# EAGLE design KRSTI Comunication (EAGLE 7.7.0)
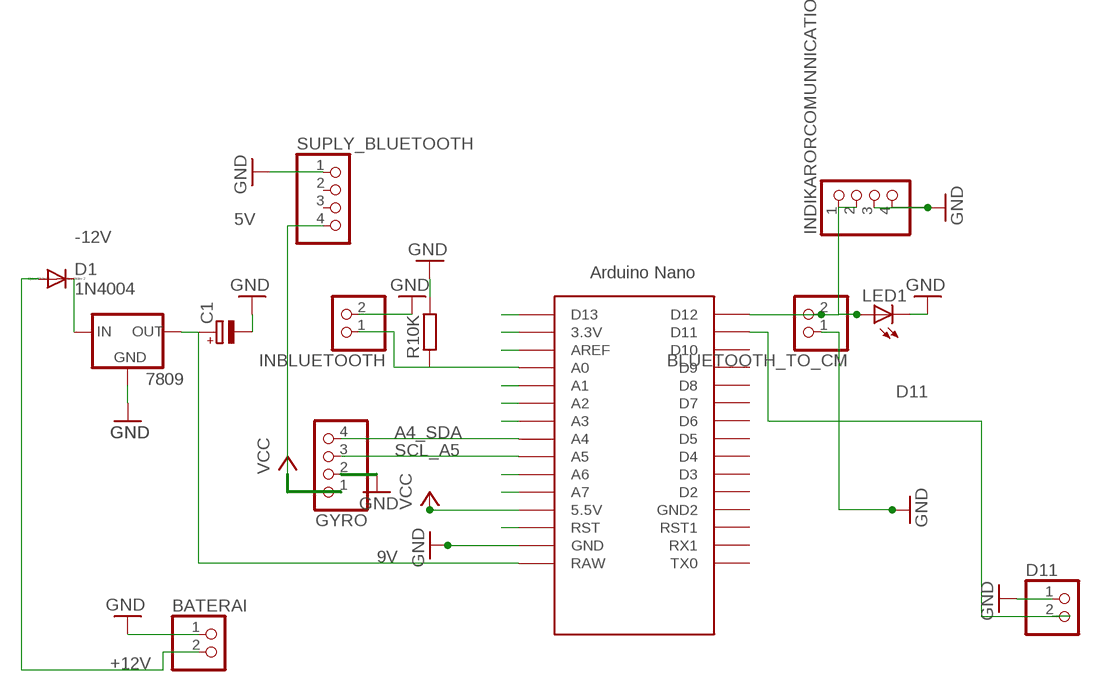
[diagram p0: schematic, sheet 1]

## Parts
7809  78XXL  [78XXL]
BATERAI  PINHD-1X2/90  [1X02/90]
BLUETOOTH_TO_CM  PINHD-1X2  [1X02]
C1  CPOL-EUE2.5-5  [E2,5-5]
D1  1N4004  [DO41-10]
D11  PINHD-1X2  [1X02]
GYRO  PINHD-1X4  [1X04]
INBLUETOOTH  PINHD-1X2  [1X02]
INDIKARORCOMUNNICATION  PINHD-1X4/90  [1X04/90]
LED1  LED5MM  [LED5MM]
R10K  R-EU_0207/7  [0207/7]
SUPLY_BLUETOOTH  PINHD-1X4  [1X04]
U$1  NANO  [NANO]

## Nets
3.3V: U$1.3.3V
5V: GYRO.1 SUPLY_BLUETOOTH.4 U$1.5V(5.5V) ; supply symbol labelled VCC
9V: 7809.OUT C1.+ U$1.RAW
+12V: BATERAI.2 D1.A
-12V: 7809.IN D1.C
A0: INBLUETOOTH.1 R10K.1 U$1.A0
A1: U$1.A1
A2: U$1.A2
A3: U$1.A3
A4_SDA: GYRO.4 U$1.A4
A6: U$1.A6
A7: U$1.A7
D11: D11.2 U$1.D11
D12: BLUETOOTH_TO_CM.2 INDIKARORCOMUNNICATION.1 INDIKARORCOMUNNICATION.2 LED1.A U$1.D12
D13: U$1.D13
GND: 7809.GND BATERAI.1 BLUETOOTH_TO_CM.1 C1.- D11.1 GYRO.2 INBLUETOOTH.2 INDIKARORCOMUNNICATION.3 INDIKARORCOMUNNICATION.4 LED1.K(C) R10K.2 SUPLY_BLUETOOTH.1 U$1.GND
N$13: U$1.AREF
RESET: U$1.RST
SCL_A5: GYRO.3 U$1.A5
Unconnected: SUPLY_BLUETOOTH.2 SUPLY_BLUETOOTH.3 U$1.D2 U$1.D3 U$1.D4 U$1.D5 U$1.D6 U$1.D7 U$1.D8 U$1.D9 U$1.D10 U$1.GND1(GND2) U$1.ICSP1 U$1.ICSP2 U$1.ICSP3 U$1.ICSP4 U$1.ICSP5 U$1.ICSP6 U$1.RST1 U$1.RX1 U$1.TX0

## Library data of the parts
7809 = v-reg:78XXL: VOLTAGE REGULATOR
BATERAI BLUETOOTH_TO_CM D11 INBLUETOOTH = pinhead:PINHD-1X2: PIN HEADER
C1 = resistor:CPOL-EU: POLARIZED CAPACITOR, European symbol
D1 = diode:1N4004: DIODE general purpose rectifier, 1 A
GYRO INDIKARORCOMUNNICATION SUPLY_BLUETOOTH = pinhead:PINHD-1X4: PIN HEADER
LED1 = led:LED: LED OSRAM: - CHIPLED LG R971, LG N971, LY N971, LG Q971, LY Q971, LO R971, LY R971 LH N974, LH R974 LS Q976, LO Q976, LY Q976 LO Q996 - Hyper CHIPLED LW Q18S LB Q993, LB Q99A, LB R99A - SideLED LS A670, LO A670, LY A670, LG A670, LP A670 LB A673, LV A673, LT A673, LW A673 LH A674 LY A675 LS A676, LA A676, LO A676, LY A676, LW A676 LS A679, LY A679, LG A679 - Hyper Micro SIDELED® LS Y876, LA Y876, LO Y876, LY Y876 LT Y87S - SmartLED LW L88C, LW L88S LB L89C, LB L89S, LG L890 LS L89K, LO L89K, LY L89K LS L896, LA L896, LO L896, LY L896 - TOPLED LS T670, LO T670, LY T670, LG T670, LP T670 LSG T670, LSP T670, LSY T670, LOP T670, LYG T670 LG T671, LOG T671, LSG T671 LB T673, LV T673, LT T673, LW T673 LH T674 LS T676, LA T676, LO T676, LY T676, LB T676, LH T676, LSB T676, LW T676 LB T67C, LV T67C, LT T67C, LS T67K, LO T67K, LY T67K, LW E67C LS E67B, LA E67B, LO E67B, LY E67B, LB E67C, LV E67C, LT E67C LW T67C LS T679, LY T679, LG T679 LS T770, LO T770, LY T770, LG T770, LP T770 LB T773, LV T773, LT T773, LW T773 LH T774 LS E675, LA E675, LY E675, LS T675 LS T776, LA T776, LO T776, LY T776, LB T776 LHGB T686 LT T68C, LB T68C - Hyper Mini TOPLED® LB M676 - Mini TOPLED Santana® LG M470 LS M47K, LO M47K, LY M47K Source: http://www.osram.convergy.de LUXEON: - LUMILED® LXK2-PW12-R00, LXK2-PW12-S00, LXK2-PW14-U00, LXK2-PW14-V00 LXK2-PM12-R00, LXK2-PM12-S00, LXK2-PM14-U00 LXK2-PE12-Q00, LXK2-PE12-R00, LXK2-PE12-S00, LXK2-PE14-T00, LXK2-PE14-U00 LXK2-PB12-K00, LXK2-PB12-L00, LXK2-PB12-M00, LXK2-PB14-N00, LXK2-PB14-P00, LXK2-PB14-Q00 LXK2-PR12-L00, LXK2-PR12-M00, LXK2-PR14-Q00, LXK2-PR14-R00 LXK2-PD12-Q00, LXK2-PD12-R00, LXK2-PD12-S00 LXK2-PH12-R00, LXK2-PH12-S00 LXK2-PL12-P00, LXK2-PL12-Q00, LXK2-PL12-R00 Source: www.luxeon.com KINGBRIGHT: KA-3528ASYC Source: www.kingbright.com
R10K = resistor:R-EU_: RESISTOR, European symbol
U$1 = Arduino-clone:NANO: Arduino Nano

## Board
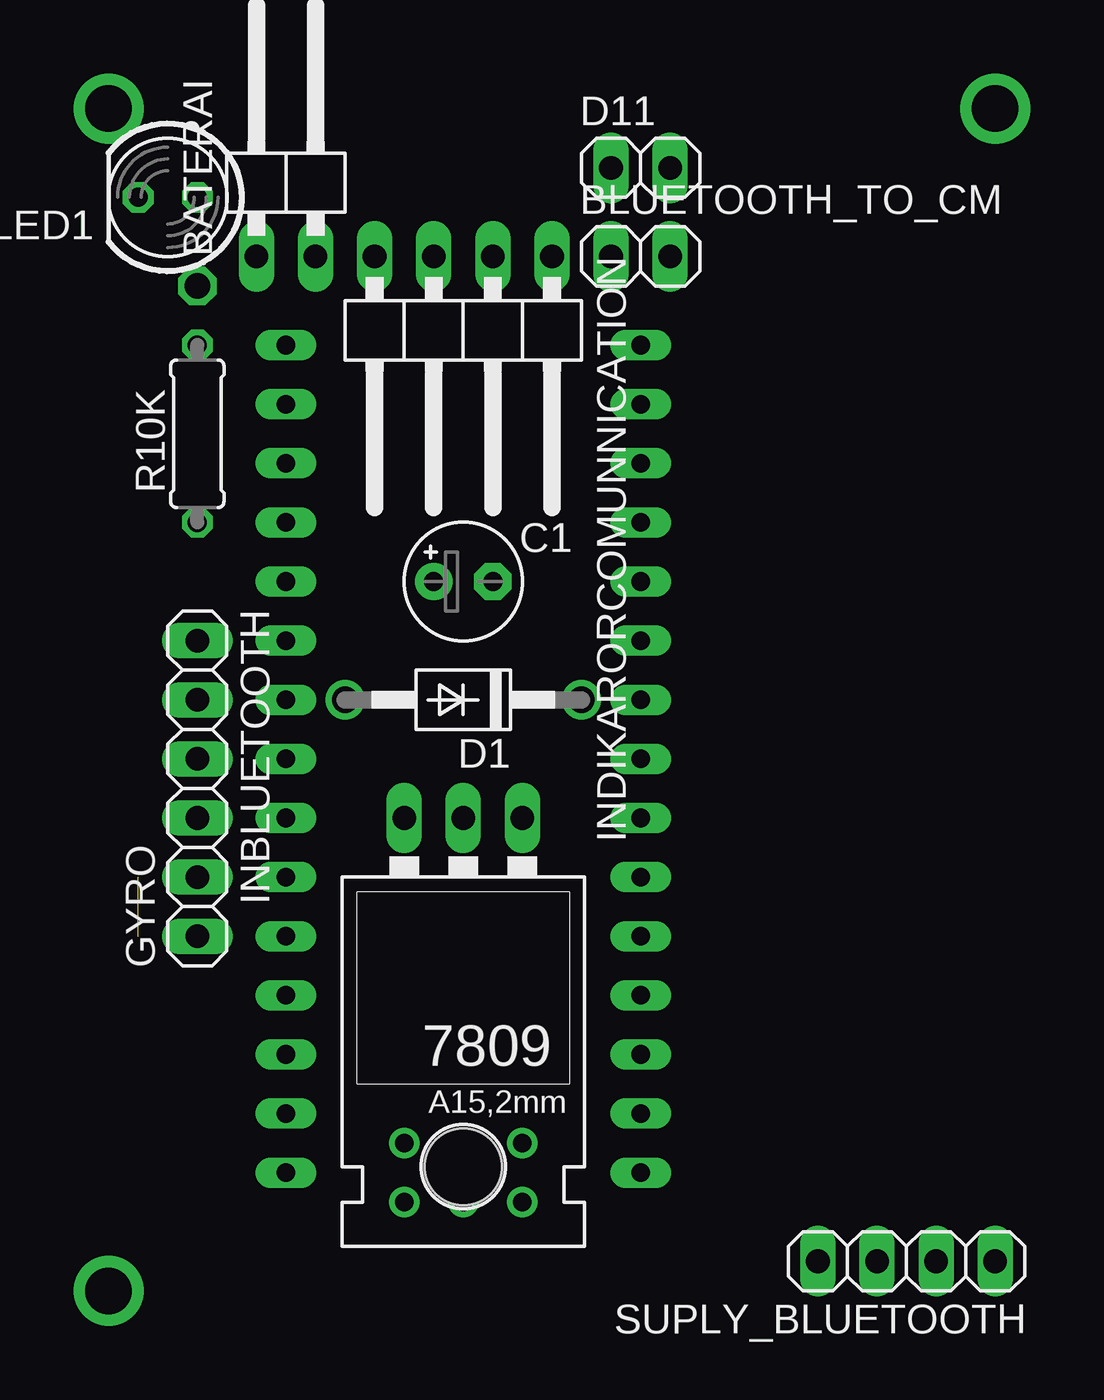
[diagram p1: board, top side]
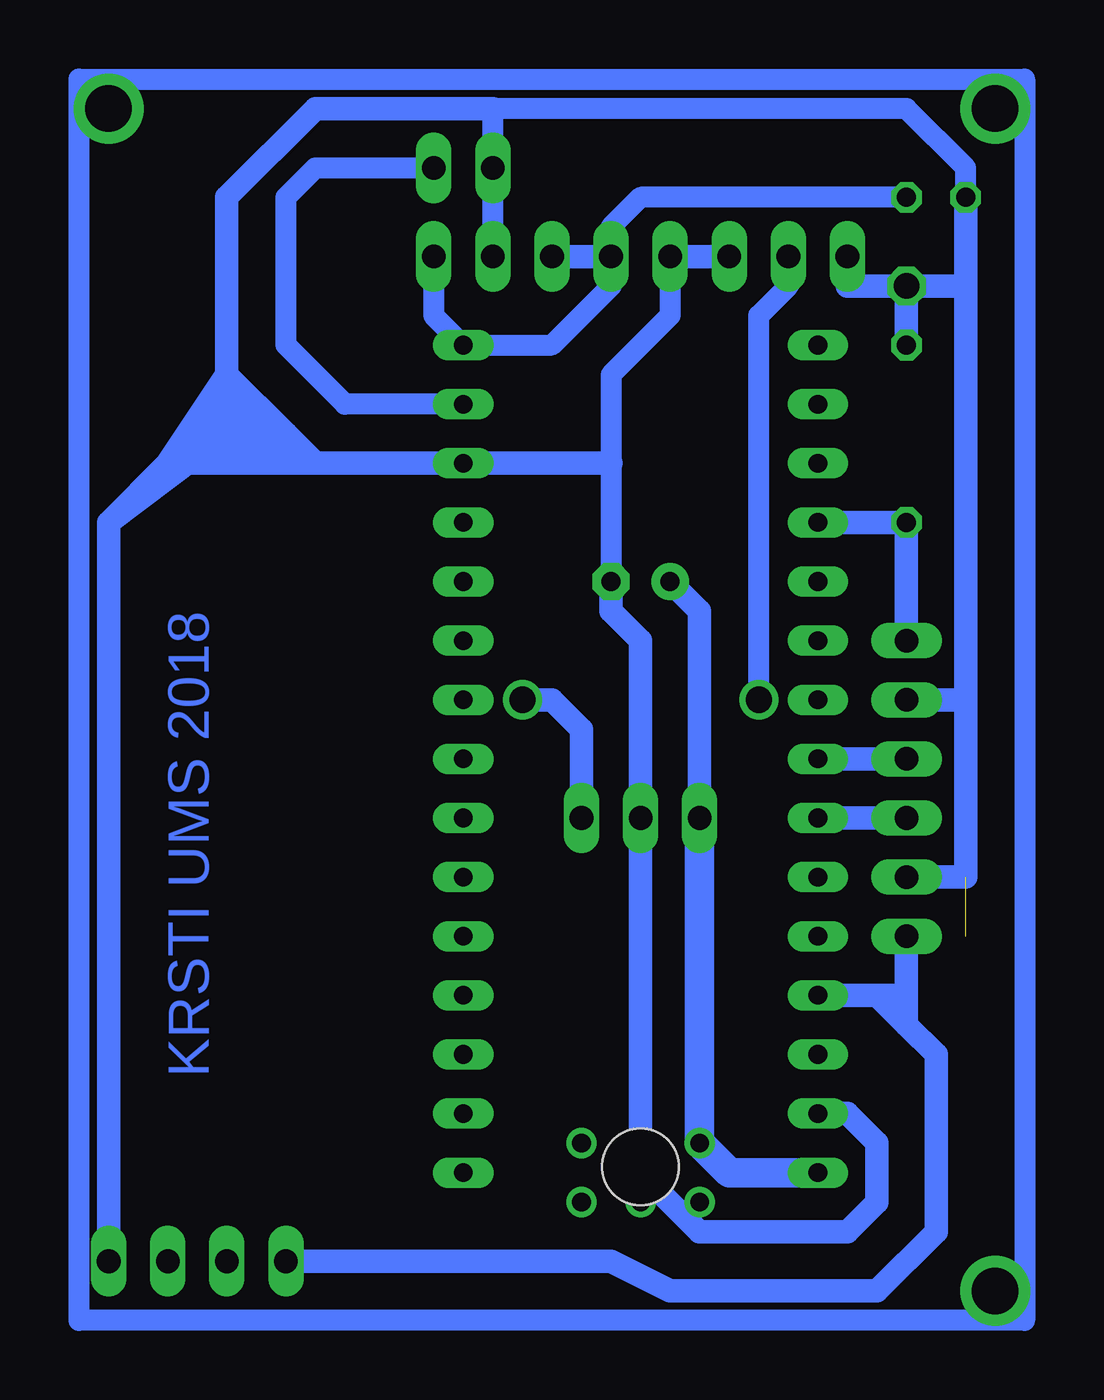
[diagram p2: board, bottom side, seen from below]

No outline drawn. Coordinates in mm, seen from the top.
Copper layers (1*16): Top 0.035mm / dielectric 1.5mm / Bottom 0.035mm
Design rules "default": minimum track width 10mil, minimum drill 24mil, track to track 8mil, track to pad 8mil, pad to pad 8mil, via to via 8mil, smd to smd 8mil, copper to edge 40mil, drill to drill 8mil, minimum pad ring 10mil, minimum via ring 8mil, stop-mask expansion 4mil, vias tented up to drill 0mil, thermal gap 10mil

### Footprints (pad centres in the part's own frame; a part is rotated, then mirrored left to right if it is on the bottom)
78XXL = drill 1.016 long: GND 0,-3.81; IN -2.54,-3.81; OUT 2.54,-3.81 | hole 3.302: 0,11.176
1X02/90 = drill 1.016 long: 1 -1.27,-3.81; 2 1.27,-3.81
1X02 = drill 1.016 long: 1 -1.27,0; 2 1.27,0
E2,5-5 = drill 0.813 pad 1.6: + -1.27,0 | drill 0.813 pad 1.6 octagon: - 1.27,0
DO41-10 = drill 1.118: A 5.08,0; C -5.08,0
1X04 = drill 1.016 long: 1 -3.81,0; 2 -1.27,0; 3 1.27,0; 4 3.81,0
1X04/90 = drill 1.016 long: 1 -3.81,-3.81; 2 -1.27,-3.81; 3 1.27,-3.81; 4 3.81,-3.81
LED5MM = drill 0.813 octagon: A -1.27,0; K 1.27,0
0207/7 = drill 0.813 octagon: 1 -3.81,0; 2 3.81,0
NANO = drill 0.8 long: 3.3V -10.16,24.13; 5V -10.16,-1.27; A0 -10.16,19.05; A1 -10.16,16.51; A2 -10.16,13.97; A3 -10.16,11.43; A4 -10.16,8.89; A5 -10.16,6.35; A6 -10.16,3.81; A7 -10.16,1.27; AREF -10.16,21.59; D2 5.08,1.27; D3 5.08,3.81; D4 5.08,6.35; D5 5.08,8.89; D6 5.08,11.43; D7 5.08,13.97; D8 5.08,16.51; D9 5.08,19.05; D10 5.08,21.59; D11 5.08,24.13; D12 5.08,26.67; D13 -10.16,26.67; GND -10.16,-6.35; GND1 5.08,-1.27; RAW -10.16,-8.89; RST -10.16,-3.81; RST1 5.08,-3.81; RX1 5.08,-6.35; TX0 5.08,-8.89 | drill 0.8: ICSP1 -5.08,-10.16; ICSP2 -5.08,-7.62; ICSP3 -2.54,-10.16; ICSP4 -2.54,-7.62; ICSP5 0,-10.16; ICSP6 0,-7.62

### Placement (x,y rotation side)
7809  24.13,45.72 180 top
BATERAI  16.51,77.47 0 top
BLUETOOTH_TO_CM  31.75,73.66 0 top
C1  24.13,59.69 0 top
D1  24.13,54.61 180 top
D11  31.75,77.47 0 top
GYRO  12.7,48.26 90 top
INBLUETOOTH  12.7,55.88 270 top
INDIKARORCOMUNNICATION  24.13,69.85 180 top
LED1  11.43,76.2 180 top
R10K  12.7,66.04 90 top
SUPLY_BLUETOOTH  43.18,30.48 180 top
U$1  26.67,43.18 0 top

### Tracks (layer width: path | path; a pad name or v marks a point on that pad's centre or on a via)
5V
  Bottom 1.016: 13.97,41.91 12.7,40.64 | SUPLY_BLUETOOTH.4 25.4,30.48 22.86,29.21 13.97,29.21 11.43,31.75 11.43,39.37 12.7,40.64 | GYRO.1 12.7,41.91 | 12.7,41.91 12.7,40.64 | U$1.5V 12.7,41.91
9V
  Bottom 1.016: 7809.OUT 21.59,58.42 C1.+
  Bottom 1.27: U$1.RAW 20.32,34.29 21.59,35.56 7809.OUT
+12V
  Bottom 0.9: D1.A 19.05,71.12 17.78,72.39 BATERAI.2
-12V
  Bottom 1.016: 7809.IN 26.67,53.34 27.94,54.61 D1.C
A0
  Bottom 1: INBLUETOOTH.1 R10K.1
  Bottom 1.016: U$1.A0 R10K.1
A4_SDA
  Bottom 1: U$1.A4 GYRO.4
D11
  Bottom 0.9: U$1.D11 36.83,67.31 39.37,69.85 39.37,76.2 38.1,77.47 D11.2
D12
  Bottom 0.9: LED1.A 24.13,76.2 25.4,74.93 INDIKARORCOMUNNICATION.2 25.4,72.39 27.94,69.85 U$1.D12 33.02,71.12 BLUETOOTH_TO_CM.2
  Bottom 1.016: INDIKARORCOMUNNICATION.1 INDIKARORCOMUNNICATION.2
GND  (via drill 1.1)  (1 unrouted)
  Bottom 0.9: C1.- 25.4,64.77 25.4,68.58 22.86,71.12 INDIKARORCOMUNNICATION.3 | BLUETOOTH_TO_CM.1 D11.1 30.48,80.01 12.7,80.01 10.16,77.47 LED1.K
  Bottom 1.016: C1.- 25.4,58.42 24.13,57.15 7809.GND 24.13,34.29 21.59,31.75 15.24,31.75 13.97,33.02 13.97,35.56 15.24,36.83 U$1.GND | 10.16,54.61 10.16,46.99 GYRO.2 | INBLUETOOTH.2 10.16,54.61 | INDIKARORCOMUNNICATION.3 INDIKARORCOMUNNICATION.4 | BATERAI.1 15.24,72.39 v12.7,72.39 | 10.16,54.61 10.16,72.39 | 10.16,72.39 LED1.K | v12.7,72.39 10.16,72.39 | R10K.2 v12.7,72.39 | SUPLY_BLUETOOTH.1 46.99,62.23 | 30.48,80.01 38.1,80.01 41.91,76.2 41.91,68.58 | 41.91,66.04 41.91,64.77 | 46.99,62.23 41.91,66.04 | 41.91,68.58 39.37,66.04 | 39.37,66.04 38.1,64.77 | 40.64,64.77 41.91,64.77 | 38.1,64.77 39.37,64.77 | 39.37,64.77 40.64,64.77 | 39.37,64.77 39.37,66.04 | 39.37,66.04 40.64,66.04 | 40.64,64.77 40.64,66.04 | 40.64,66.04 41.91,66.04 | 41.91,66.04 41.91,67.31 | 41.91,68.58 41.91,67.31 | 41.91,67.31 40.64,66.04 | 41.91,66.04 40.64,64.77 | 40.64,64.77 39.37,66.04 | 38.1,64.77 25.4,64.77 | 41.91,68.58 44.45,64.77 | 44.45,64.77 41.91,67.31 | 44.45,64.77 46.99,62.23 | 41.91,64.77 44.45,64.77
N$1
  Bottom 0.9: 48.26,27.94 48.26,81.28 7.62,81.28 7.62,27.94 48.26,27.94
N$2  (via drill 2)
  other vias: 8.89,29.21
N$3  (via drill 2)
  other vias: 8.89,80.01
N$4  (via drill 2)
  other vias: 46.99,80.01
SCL_A5
  Bottom 1: GYRO.3 U$1.A5

### Text on the board
Bottom: KRSTI UMS 2018